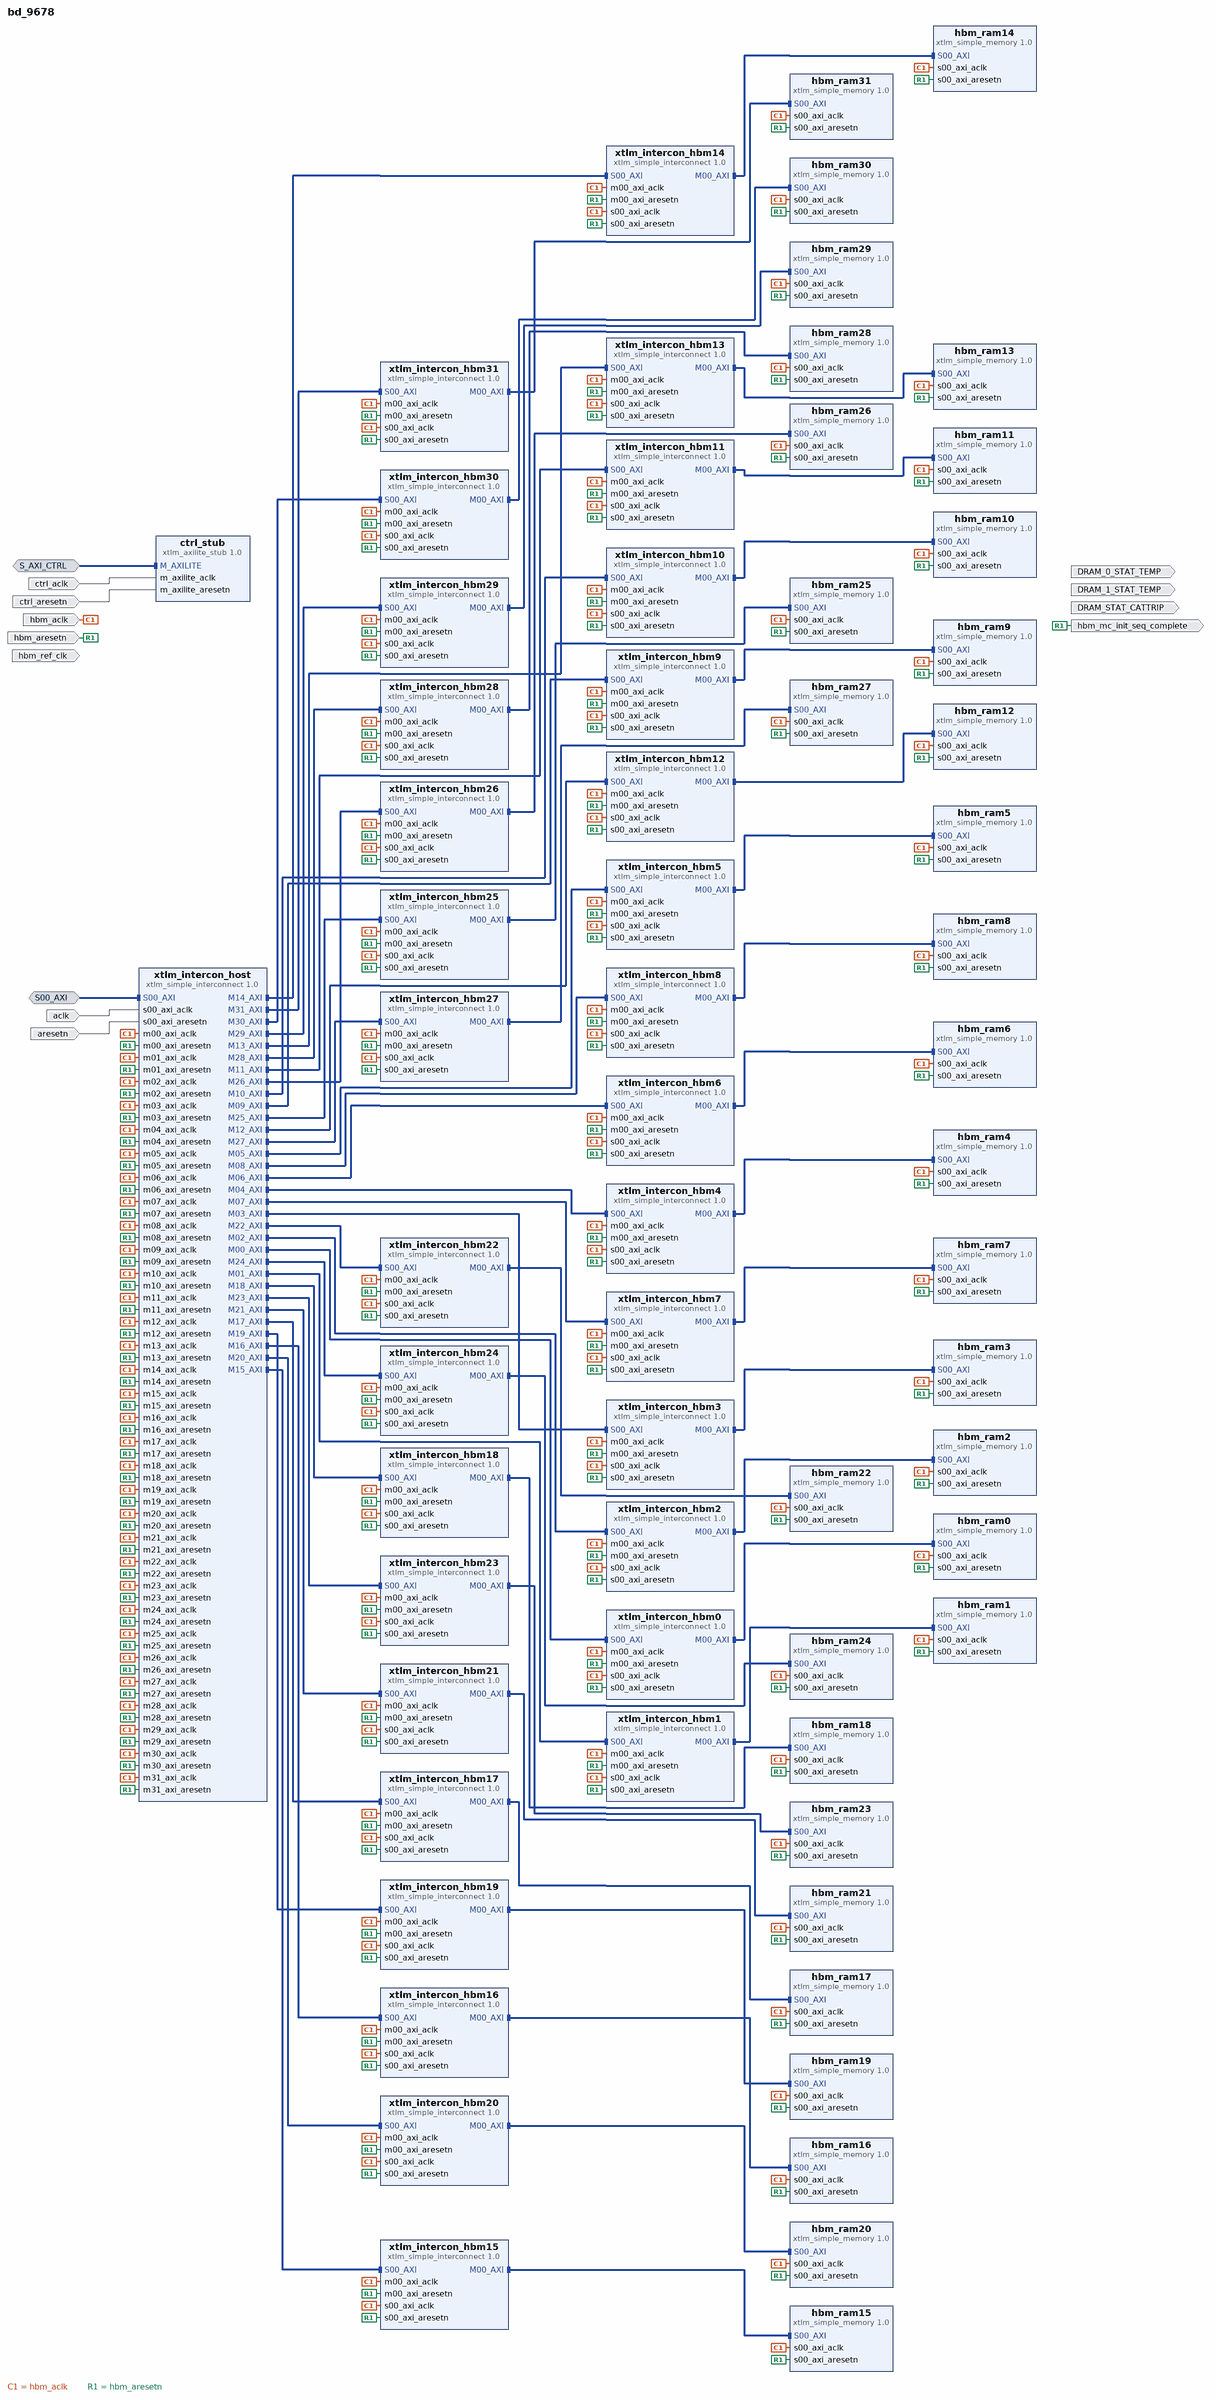
[diagram p0: block diagram of the top level]
# Vivado block design bd_9678, xcu50-fsvh2104-2-e, Vivado 2019.2.1
create_bd_design bd_9678

create_bd_intf_port -mode Slave -vlnv xilinx.com:interface:aximm_rtl:1.0 S_AXI_CTRL
set_property -dict {CONFIG.PROTOCOL AXI4LITE CONFIG.ADDR_WIDTH 23} [get_bd_intf_ports S_AXI_CTRL]
create_bd_intf_port -mode Slave -vlnv xilinx.com:interface:aximm_rtl:1.0 S00_AXI
set_property -dict {CONFIG.ADDR_WIDTH 33} [get_bd_intf_ports S00_AXI]
create_bd_port -dir I -type clk hbm_aclk
create_bd_port -dir I -type rst hbm_aresetn
set_property -dict {CONFIG.POLARITY ACTIVE_LOW} [get_bd_ports hbm_aresetn]
create_bd_port -dir I -type clk hbm_ref_clk
create_bd_port -dir O hbm_mc_init_seq_complete
create_bd_port -dir O DRAM_0_STAT_TEMP
create_bd_port -dir O DRAM_1_STAT_TEMP
create_bd_port -dir O -type intr DRAM_STAT_CATTRIP
create_bd_port -dir I -type clk ctrl_aclk
set_property -dict {CONFIG.ASSOCIATED_BUSIF S_AXI_CTRL CONFIG.ASSOCIATED_RESET ctrl_aresetn} [get_bd_ports ctrl_aclk]
create_bd_port -dir I -type rst ctrl_aresetn
set_property -dict {CONFIG.POLARITY ACTIVE_LOW} [get_bd_ports ctrl_aresetn]
create_bd_port -dir I -type clk aclk
create_bd_port -dir I -type rst aresetn
set_property -dict {CONFIG.POLARITY ACTIVE_LOW} [get_bd_ports aresetn]

create_bd_cell -type ip -vlnv xilinx.com:xilinx:xtlm_simple_interconnect:1.0 xtlm_intercon_host
set_property -dict [list \
  CONFIG.C_M00_A00_ADDR_RANGE 0x0000000010000000 \
  CONFIG.C_M00_A00_BASE_ADDRESS 0x0 \
  CONFIG.C_M00_AXI_ADDR_WIDTH 28 \
  CONFIG.C_M00_AXI_DATA_WIDTH 256 \
  CONFIG.C_M00_AXI_ID_WIDTH 16 \
  CONFIG.C_M00_S00_CONNECTIVITY 1 \
  CONFIG.C_M01_A00_ADDR_RANGE 0x0000000010000000 \
  CONFIG.C_M01_A00_BASE_ADDRESS 0x0000000010000000 \
  CONFIG.C_M01_AXI_ADDR_WIDTH 28 \
  CONFIG.C_M01_AXI_DATA_WIDTH 256 \
  CONFIG.C_M01_AXI_ID_WIDTH 16 \
  CONFIG.C_M01_S00_CONNECTIVITY 1 \
  CONFIG.C_M02_A00_ADDR_RANGE 0x0000000010000000 \
  CONFIG.C_M02_A00_BASE_ADDRESS 0x0000000020000000 \
  CONFIG.C_M02_AXI_ADDR_WIDTH 28 \
  CONFIG.C_M02_AXI_DATA_WIDTH 256 \
  CONFIG.C_M02_AXI_ID_WIDTH 16 \
  CONFIG.C_M02_S00_CONNECTIVITY 1 \
  CONFIG.C_M03_A00_ADDR_RANGE 0x0000000010000000 \
  CONFIG.C_M03_A00_BASE_ADDRESS 0x0000000030000000 \
  CONFIG.C_M03_AXI_ADDR_WIDTH 28 \
  CONFIG.C_M03_AXI_DATA_WIDTH 256 \
  CONFIG.C_M03_AXI_ID_WIDTH 16 \
  CONFIG.C_M03_S00_CONNECTIVITY 1 \
  CONFIG.C_M04_A00_ADDR_RANGE 0x0000000010000000 \
  CONFIG.C_M04_A00_BASE_ADDRESS 0x0000000040000000 \
  CONFIG.C_M04_AXI_ADDR_WIDTH 28 \
  CONFIG.C_M04_AXI_DATA_WIDTH 256 \
  CONFIG.C_M04_AXI_ID_WIDTH 16 \
  CONFIG.C_M04_S00_CONNECTIVITY 1 \
  CONFIG.C_M05_A00_ADDR_RANGE 0x0000000010000000 \
  CONFIG.C_M05_A00_BASE_ADDRESS 0x0000000050000000 \
  CONFIG.C_M05_AXI_ADDR_WIDTH 28 \
  CONFIG.C_M05_AXI_DATA_WIDTH 256 \
  CONFIG.C_M05_AXI_ID_WIDTH 16 \
  CONFIG.C_M05_S00_CONNECTIVITY 1 \
  CONFIG.C_M06_A00_ADDR_RANGE 0x0000000010000000 \
  CONFIG.C_M06_A00_BASE_ADDRESS 0x0000000060000000 \
  CONFIG.C_M06_AXI_ADDR_WIDTH 28 \
  CONFIG.C_M06_AXI_DATA_WIDTH 256 \
  CONFIG.C_M06_AXI_ID_WIDTH 16 \
  CONFIG.C_M06_S00_CONNECTIVITY 1 \
  CONFIG.C_M07_A00_ADDR_RANGE 0x0000000010000000 \
  CONFIG.C_M07_A00_BASE_ADDRESS 0x0000000070000000 \
  CONFIG.C_M07_AXI_ADDR_WIDTH 28 \
  CONFIG.C_M07_AXI_DATA_WIDTH 256 \
  CONFIG.C_M07_AXI_ID_WIDTH 16 \
  CONFIG.C_M07_S00_CONNECTIVITY 1 \
  CONFIG.C_M08_A00_ADDR_RANGE 0x0000000010000000 \
  CONFIG.C_M08_A00_BASE_ADDRESS 0x0000000080000000 \
  CONFIG.C_M08_AXI_ADDR_WIDTH 28 \
  CONFIG.C_M08_AXI_DATA_WIDTH 256 \
  CONFIG.C_M08_AXI_ID_WIDTH 16 \
  CONFIG.C_M08_S00_CONNECTIVITY 1 \
  CONFIG.C_M09_A00_ADDR_RANGE 0x0000000010000000 \
  CONFIG.C_M09_A00_BASE_ADDRESS 0x0000000090000000 \
  CONFIG.C_M09_AXI_ADDR_WIDTH 28 \
  CONFIG.C_M09_AXI_DATA_WIDTH 256 \
  CONFIG.C_M09_AXI_ID_WIDTH 16 \
  CONFIG.C_M09_S00_CONNECTIVITY 1 \
  CONFIG.C_M10_A00_ADDR_RANGE 0x0000000010000000 \
  CONFIG.C_M10_A00_BASE_ADDRESS 0x00000000A0000000 \
  CONFIG.C_M10_AXI_ADDR_WIDTH 28 \
  CONFIG.C_M10_AXI_DATA_WIDTH 256 \
  CONFIG.C_M10_AXI_ID_WIDTH 16 \
  CONFIG.C_M10_S00_CONNECTIVITY 1 \
  CONFIG.C_M11_A00_ADDR_RANGE 0x0000000010000000 \
  CONFIG.C_M11_A00_BASE_ADDRESS 0x00000000B0000000 \
  CONFIG.C_M11_AXI_ADDR_WIDTH 28 \
  CONFIG.C_M11_AXI_DATA_WIDTH 256 \
  CONFIG.C_M11_AXI_ID_WIDTH 16 \
  CONFIG.C_M11_S00_CONNECTIVITY 1 \
  CONFIG.C_M12_A00_ADDR_RANGE 0x0000000010000000 \
  CONFIG.C_M12_A00_BASE_ADDRESS 0x00000000C0000000 \
  CONFIG.C_M12_AXI_ADDR_WIDTH 28 \
  CONFIG.C_M12_AXI_DATA_WIDTH 256 \
  CONFIG.C_M12_AXI_ID_WIDTH 16 \
  CONFIG.C_M12_S00_CONNECTIVITY 1 \
  CONFIG.C_M13_A00_ADDR_RANGE 0x0000000010000000 \
  CONFIG.C_M13_A00_BASE_ADDRESS 0x00000000D0000000 \
  CONFIG.C_M13_AXI_ADDR_WIDTH 28 \
  CONFIG.C_M13_AXI_DATA_WIDTH 256 \
  CONFIG.C_M13_AXI_ID_WIDTH 16 \
  CONFIG.C_M13_S00_CONNECTIVITY 1 \
  CONFIG.C_M14_A00_ADDR_RANGE 0x0000000010000000 \
  CONFIG.C_M14_A00_BASE_ADDRESS 0x00000000E0000000 \
  CONFIG.C_M14_AXI_ADDR_WIDTH 28 \
  CONFIG.C_M14_AXI_DATA_WIDTH 256 \
  CONFIG.C_M14_AXI_ID_WIDTH 16 \
  CONFIG.C_M14_S00_CONNECTIVITY 1 \
  CONFIG.C_M15_A00_ADDR_RANGE 0x0000000010000000 \
  CONFIG.C_M15_A00_BASE_ADDRESS 0x00000000F0000000 \
  CONFIG.C_M15_AXI_ADDR_WIDTH 28 \
  CONFIG.C_M15_AXI_DATA_WIDTH 256 \
  CONFIG.C_M15_AXI_ID_WIDTH 16 \
  CONFIG.C_M15_S00_CONNECTIVITY 1 \
  CONFIG.C_M16_A00_ADDR_RANGE 0x0000000010000000 \
  CONFIG.C_M16_A00_BASE_ADDRESS 0x0000000100000000 \
  CONFIG.C_M16_AXI_ADDR_WIDTH 28 \
  CONFIG.C_M16_AXI_DATA_WIDTH 256 \
  CONFIG.C_M16_AXI_ID_WIDTH 16 \
  CONFIG.C_M16_S00_CONNECTIVITY 1 \
  CONFIG.C_M17_A00_ADDR_RANGE 0x0000000010000000 \
  CONFIG.C_M17_A00_BASE_ADDRESS 0x0000000110000000 \
  CONFIG.C_M17_AXI_ADDR_WIDTH 28 \
  CONFIG.C_M17_AXI_DATA_WIDTH 256 \
  CONFIG.C_M17_AXI_ID_WIDTH 16 \
  CONFIG.C_M17_S00_CONNECTIVITY 1 \
  CONFIG.C_M18_A00_ADDR_RANGE 0x0000000010000000 \
  CONFIG.C_M18_A00_BASE_ADDRESS 0x0000000120000000 \
  CONFIG.C_M18_AXI_ADDR_WIDTH 28 \
  CONFIG.C_M18_AXI_DATA_WIDTH 256 \
  CONFIG.C_M18_AXI_ID_WIDTH 16 \
  CONFIG.C_M18_S00_CONNECTIVITY 1 \
  CONFIG.C_M19_A00_ADDR_RANGE 0x0000000010000000 \
  CONFIG.C_M19_A00_BASE_ADDRESS 0x0000000130000000 \
  CONFIG.C_M19_AXI_ADDR_WIDTH 28 \
  CONFIG.C_M19_AXI_DATA_WIDTH 256 \
  CONFIG.C_M19_AXI_ID_WIDTH 16 \
  CONFIG.C_M19_S00_CONNECTIVITY 1 \
  CONFIG.C_M20_A00_ADDR_RANGE 0x0000000010000000 \
  CONFIG.C_M20_A00_BASE_ADDRESS 0x0000000140000000 \
  CONFIG.C_M20_AXI_ADDR_WIDTH 28 \
  CONFIG.C_M20_AXI_DATA_WIDTH 256 \
  CONFIG.C_M20_AXI_ID_WIDTH 16 \
  CONFIG.C_M20_S00_CONNECTIVITY 1 \
  CONFIG.C_M21_A00_ADDR_RANGE 0x0000000010000000 \
  CONFIG.C_M21_A00_BASE_ADDRESS 0x0000000150000000 \
  CONFIG.C_M21_AXI_ADDR_WIDTH 28 \
  CONFIG.C_M21_AXI_DATA_WIDTH 256 \
  CONFIG.C_M21_AXI_ID_WIDTH 16 \
  CONFIG.C_M21_S00_CONNECTIVITY 1 \
  CONFIG.C_M22_A00_ADDR_RANGE 0x0000000010000000 \
  CONFIG.C_M22_A00_BASE_ADDRESS 0x0000000160000000 \
  CONFIG.C_M22_AXI_ADDR_WIDTH 28 \
  CONFIG.C_M22_AXI_DATA_WIDTH 256 \
  CONFIG.C_M22_AXI_ID_WIDTH 16 \
  CONFIG.C_M22_S00_CONNECTIVITY 1 \
  CONFIG.C_M23_A00_ADDR_RANGE 0x0000000010000000 \
  CONFIG.C_M23_A00_BASE_ADDRESS 0x0000000170000000 \
  CONFIG.C_M23_AXI_ADDR_WIDTH 28 \
  CONFIG.C_M23_AXI_DATA_WIDTH 256 \
  CONFIG.C_M23_AXI_ID_WIDTH 16 \
  CONFIG.C_M23_S00_CONNECTIVITY 1 \
  CONFIG.C_M24_A00_ADDR_RANGE 0x0000000010000000 \
  CONFIG.C_M24_A00_BASE_ADDRESS 0x0000000180000000 \
  CONFIG.C_M24_AXI_ADDR_WIDTH 28 \
  CONFIG.C_M24_AXI_DATA_WIDTH 256 \
  CONFIG.C_M24_AXI_ID_WIDTH 16 \
  CONFIG.C_M24_S00_CONNECTIVITY 1 \
  CONFIG.C_M25_A00_ADDR_RANGE 0x0000000010000000 \
  CONFIG.C_M25_A00_BASE_ADDRESS 0x0000000190000000 \
  CONFIG.C_M25_AXI_ADDR_WIDTH 28 \
  CONFIG.C_M25_AXI_DATA_WIDTH 256 \
  CONFIG.C_M25_AXI_ID_WIDTH 16 \
  CONFIG.C_M25_S00_CONNECTIVITY 1 \
  CONFIG.C_M26_A00_ADDR_RANGE 0x0000000010000000 \
  CONFIG.C_M26_A00_BASE_ADDRESS 0x00000001A0000000 \
  CONFIG.C_M26_AXI_ADDR_WIDTH 28 \
  CONFIG.C_M26_AXI_DATA_WIDTH 256 \
  CONFIG.C_M26_AXI_ID_WIDTH 16 \
  CONFIG.C_M26_S00_CONNECTIVITY 1 \
  CONFIG.C_M27_A00_ADDR_RANGE 0x0000000010000000 \
  CONFIG.C_M27_A00_BASE_ADDRESS 0x00000001B0000000 \
  CONFIG.C_M27_AXI_ADDR_WIDTH 28 \
  CONFIG.C_M27_AXI_DATA_WIDTH 256 \
  CONFIG.C_M27_AXI_ID_WIDTH 16 \
  CONFIG.C_M27_S00_CONNECTIVITY 1 \
  CONFIG.C_M28_A00_ADDR_RANGE 0x0000000010000000 \
  CONFIG.C_M28_A00_BASE_ADDRESS 0x00000001C0000000 \
  CONFIG.C_M28_AXI_ADDR_WIDTH 28 \
  CONFIG.C_M28_AXI_DATA_WIDTH 256 \
  CONFIG.C_M28_AXI_ID_WIDTH 16 \
  CONFIG.C_M28_S00_CONNECTIVITY 1 \
  CONFIG.C_M29_A00_ADDR_RANGE 0x0000000010000000 \
  CONFIG.C_M29_A00_BASE_ADDRESS 0x00000001D0000000 \
  CONFIG.C_M29_AXI_ADDR_WIDTH 28 \
  CONFIG.C_M29_AXI_DATA_WIDTH 256 \
  CONFIG.C_M29_AXI_ID_WIDTH 16 \
  CONFIG.C_M29_S00_CONNECTIVITY 1 \
  CONFIG.C_M30_A00_ADDR_RANGE 0x0000000010000000 \
  CONFIG.C_M30_A00_BASE_ADDRESS 0x00000001E0000000 \
  CONFIG.C_M30_AXI_ADDR_WIDTH 28 \
  CONFIG.C_M30_AXI_DATA_WIDTH 256 \
  CONFIG.C_M30_AXI_ID_WIDTH 16 \
  CONFIG.C_M30_S00_CONNECTIVITY 1 \
  CONFIG.C_M31_A00_ADDR_RANGE 0x0000000010000000 \
  CONFIG.C_M31_A00_BASE_ADDRESS 0x00000001F0000000 \
  CONFIG.C_M31_AXI_ADDR_WIDTH 28 \
  CONFIG.C_M31_AXI_DATA_WIDTH 256 \
  CONFIG.C_M31_AXI_ID_WIDTH 16 \
  CONFIG.C_M31_S00_CONNECTIVITY 1 \
  CONFIG.C_NUM_MI 32 \
  CONFIG.C_NUM_SI 1 \
  CONFIG.C_S00_AXI_ADDR_WIDTH 64 \
  CONFIG.C_S00_AXI_ARUSER_WIDTH 1 \
  CONFIG.C_S00_AXI_AWUSER_WIDTH 1 \
  CONFIG.C_S00_AXI_BUSER_WIDTH 1 \
  CONFIG.C_S00_AXI_DATA_WIDTH 32 \
  CONFIG.C_S00_AXI_HAS_BRESP true \
  CONFIG.C_S00_AXI_HAS_BURST true \
  CONFIG.C_S00_AXI_HAS_CACHE true \
  CONFIG.C_S00_AXI_HAS_LOCK true \
  CONFIG.C_S00_AXI_HAS_PROT true \
  CONFIG.C_S00_AXI_HAS_QOS true \
  CONFIG.C_S00_AXI_HAS_REGION false \
  CONFIG.C_S00_AXI_HAS_RRESP true \
  CONFIG.C_S00_AXI_HAS_WSTRB true \
  CONFIG.C_S00_AXI_ID_WIDTH 1 \
  CONFIG.C_S00_AXI_RUSER_WIDTH 1 \
  CONFIG.C_S00_AXI_WUSER_WIDTH 1 \
] [get_bd_cells xtlm_intercon_host]
create_bd_cell -type ip -vlnv xilinx.com:xilinx:xtlm_simple_memory:1.0 hbm_ram0
set_property -dict [list \
  CONFIG.C_MEM_SIZE 0x0000000010000000 \
  CONFIG.C_S00_AXI_ADDR_WIDTH 28 \
  CONFIG.C_S00_AXI_BASEADDR 0x00000000 \
  CONFIG.C_S00_AXI_DATA_WIDTH 256 \
  CONFIG.C_S00_AXI_HIGHADDR 0x0FFFFFFF \
] [get_bd_cells hbm_ram0]
create_bd_cell -type ip -vlnv xilinx.com:xilinx:xtlm_simple_interconnect:1.0 xtlm_intercon_hbm0
set_property -dict [list \
  CONFIG.C_M00_A00_ADDR_RANGE 0x0000000010000000 \
  CONFIG.C_M00_A00_BASE_ADDRESS 0x0 \
  CONFIG.C_M00_AXI_ADDR_WIDTH 28 \
  CONFIG.C_M00_AXI_DATA_WIDTH 256 \
  CONFIG.C_M00_AXI_ID_WIDTH 16 \
  CONFIG.C_NUM_MI 1 \
  CONFIG.C_NUM_SI 1 \
  CONFIG.C_S00_AXI_ADDR_WIDTH 28 \
  CONFIG.C_S00_AXI_DATA_WIDTH 256 \
  CONFIG.C_S00_AXI_ID_WIDTH 16 \
] [get_bd_cells xtlm_intercon_hbm0]
create_bd_cell -type ip -vlnv xilinx.com:xilinx:xtlm_simple_memory:1.0 hbm_ram1
set_property -dict [list \
  CONFIG.C_MEM_SIZE 0x0000000010000000 \
  CONFIG.C_S00_AXI_ADDR_WIDTH 28 \
  CONFIG.C_S00_AXI_BASEADDR 0x00000000 \
  CONFIG.C_S00_AXI_DATA_WIDTH 256 \
  CONFIG.C_S00_AXI_HIGHADDR 0x0FFFFFFF \
] [get_bd_cells hbm_ram1]
create_bd_cell -type ip -vlnv xilinx.com:xilinx:xtlm_simple_interconnect:1.0 xtlm_intercon_hbm1
set_property -dict [list \
  CONFIG.C_M00_A00_ADDR_RANGE 0x0000000010000000 \
  CONFIG.C_M00_A00_BASE_ADDRESS 0x0000000010000000 \
  CONFIG.C_M00_AXI_ADDR_WIDTH 28 \
  CONFIG.C_M00_AXI_DATA_WIDTH 256 \
  CONFIG.C_M00_AXI_ID_WIDTH 16 \
  CONFIG.C_NUM_MI 1 \
  CONFIG.C_NUM_SI 1 \
  CONFIG.C_S00_AXI_ADDR_WIDTH 28 \
  CONFIG.C_S00_AXI_DATA_WIDTH 256 \
  CONFIG.C_S00_AXI_ID_WIDTH 16 \
] [get_bd_cells xtlm_intercon_hbm1]
create_bd_cell -type ip -vlnv xilinx.com:xilinx:xtlm_simple_memory:1.0 hbm_ram2
set_property -dict [list \
  CONFIG.C_MEM_SIZE 0x0000000010000000 \
  CONFIG.C_S00_AXI_ADDR_WIDTH 28 \
  CONFIG.C_S00_AXI_BASEADDR 0x00000000 \
  CONFIG.C_S00_AXI_DATA_WIDTH 256 \
  CONFIG.C_S00_AXI_HIGHADDR 0x0FFFFFFF \
] [get_bd_cells hbm_ram2]
create_bd_cell -type ip -vlnv xilinx.com:xilinx:xtlm_simple_interconnect:1.0 xtlm_intercon_hbm2
set_property -dict [list \
  CONFIG.C_M00_A00_ADDR_RANGE 0x0000000010000000 \
  CONFIG.C_M00_A00_BASE_ADDRESS 0x0000000020000000 \
  CONFIG.C_M00_AXI_ADDR_WIDTH 28 \
  CONFIG.C_M00_AXI_DATA_WIDTH 256 \
  CONFIG.C_M00_AXI_ID_WIDTH 16 \
  CONFIG.C_NUM_MI 1 \
  CONFIG.C_NUM_SI 1 \
  CONFIG.C_S00_AXI_ADDR_WIDTH 28 \
  CONFIG.C_S00_AXI_DATA_WIDTH 256 \
  CONFIG.C_S00_AXI_ID_WIDTH 16 \
] [get_bd_cells xtlm_intercon_hbm2]
create_bd_cell -type ip -vlnv xilinx.com:xilinx:xtlm_simple_memory:1.0 hbm_ram3
set_property -dict [list \
  CONFIG.C_MEM_SIZE 0x0000000010000000 \
  CONFIG.C_S00_AXI_ADDR_WIDTH 28 \
  CONFIG.C_S00_AXI_BASEADDR 0x00000000 \
  CONFIG.C_S00_AXI_DATA_WIDTH 256 \
  CONFIG.C_S00_AXI_HIGHADDR 0x0FFFFFFF \
] [get_bd_cells hbm_ram3]
create_bd_cell -type ip -vlnv xilinx.com:xilinx:xtlm_simple_interconnect:1.0 xtlm_intercon_hbm3
set_property -dict [list \
  CONFIG.C_M00_A00_ADDR_RANGE 0x0000000010000000 \
  CONFIG.C_M00_A00_BASE_ADDRESS 0x0000000030000000 \
  CONFIG.C_M00_AXI_ADDR_WIDTH 28 \
  CONFIG.C_M00_AXI_DATA_WIDTH 256 \
  CONFIG.C_M00_AXI_ID_WIDTH 16 \
  CONFIG.C_NUM_MI 1 \
  CONFIG.C_NUM_SI 1 \
  CONFIG.C_S00_AXI_ADDR_WIDTH 28 \
  CONFIG.C_S00_AXI_DATA_WIDTH 256 \
  CONFIG.C_S00_AXI_ID_WIDTH 16 \
] [get_bd_cells xtlm_intercon_hbm3]
create_bd_cell -type ip -vlnv xilinx.com:xilinx:xtlm_simple_memory:1.0 hbm_ram4
set_property -dict [list \
  CONFIG.C_MEM_SIZE 0x0000000010000000 \
  CONFIG.C_S00_AXI_ADDR_WIDTH 28 \
  CONFIG.C_S00_AXI_BASEADDR 0x00000000 \
  CONFIG.C_S00_AXI_DATA_WIDTH 256 \
  CONFIG.C_S00_AXI_HIGHADDR 0x0FFFFFFF \
] [get_bd_cells hbm_ram4]
create_bd_cell -type ip -vlnv xilinx.com:xilinx:xtlm_simple_interconnect:1.0 xtlm_intercon_hbm4
set_property -dict [list \
  CONFIG.C_M00_A00_ADDR_RANGE 0x0000000010000000 \
  CONFIG.C_M00_A00_BASE_ADDRESS 0x0000000040000000 \
  CONFIG.C_M00_AXI_ADDR_WIDTH 28 \
  CONFIG.C_M00_AXI_DATA_WIDTH 256 \
  CONFIG.C_M00_AXI_ID_WIDTH 16 \
  CONFIG.C_NUM_MI 1 \
  CONFIG.C_NUM_SI 1 \
  CONFIG.C_S00_AXI_ADDR_WIDTH 28 \
  CONFIG.C_S00_AXI_DATA_WIDTH 256 \
  CONFIG.C_S00_AXI_ID_WIDTH 16 \
] [get_bd_cells xtlm_intercon_hbm4]
create_bd_cell -type ip -vlnv xilinx.com:xilinx:xtlm_simple_memory:1.0 hbm_ram5
set_property -dict [list \
  CONFIG.C_MEM_SIZE 0x0000000010000000 \
  CONFIG.C_S00_AXI_ADDR_WIDTH 28 \
  CONFIG.C_S00_AXI_BASEADDR 0x00000000 \
  CONFIG.C_S00_AXI_DATA_WIDTH 256 \
  CONFIG.C_S00_AXI_HIGHADDR 0x0FFFFFFF \
] [get_bd_cells hbm_ram5]
create_bd_cell -type ip -vlnv xilinx.com:xilinx:xtlm_simple_interconnect:1.0 xtlm_intercon_hbm5
set_property -dict [list \
  CONFIG.C_M00_A00_ADDR_RANGE 0x0000000010000000 \
  CONFIG.C_M00_A00_BASE_ADDRESS 0x0000000050000000 \
  CONFIG.C_M00_AXI_ADDR_WIDTH 28 \
  CONFIG.C_M00_AXI_DATA_WIDTH 256 \
  CONFIG.C_M00_AXI_ID_WIDTH 16 \
  CONFIG.C_NUM_MI 1 \
  CONFIG.C_NUM_SI 1 \
  CONFIG.C_S00_AXI_ADDR_WIDTH 28 \
  CONFIG.C_S00_AXI_DATA_WIDTH 256 \
  CONFIG.C_S00_AXI_ID_WIDTH 16 \
] [get_bd_cells xtlm_intercon_hbm5]
create_bd_cell -type ip -vlnv xilinx.com:xilinx:xtlm_simple_memory:1.0 hbm_ram6
set_property -dict [list \
  CONFIG.C_MEM_SIZE 0x0000000010000000 \
  CONFIG.C_S00_AXI_ADDR_WIDTH 28 \
  CONFIG.C_S00_AXI_BASEADDR 0x00000000 \
  CONFIG.C_S00_AXI_DATA_WIDTH 256 \
  CONFIG.C_S00_AXI_HIGHADDR 0x0FFFFFFF \
] [get_bd_cells hbm_ram6]
create_bd_cell -type ip -vlnv xilinx.com:xilinx:xtlm_simple_interconnect:1.0 xtlm_intercon_hbm6
set_property -dict [list \
  CONFIG.C_M00_A00_ADDR_RANGE 0x0000000010000000 \
  CONFIG.C_M00_A00_BASE_ADDRESS 0x0000000060000000 \
  CONFIG.C_M00_AXI_ADDR_WIDTH 28 \
  CONFIG.C_M00_AXI_DATA_WIDTH 256 \
  CONFIG.C_M00_AXI_ID_WIDTH 16 \
  CONFIG.C_NUM_MI 1 \
  CONFIG.C_NUM_SI 1 \
  CONFIG.C_S00_AXI_ADDR_WIDTH 28 \
  CONFIG.C_S00_AXI_DATA_WIDTH 256 \
  CONFIG.C_S00_AXI_ID_WIDTH 16 \
] [get_bd_cells xtlm_intercon_hbm6]
create_bd_cell -type ip -vlnv xilinx.com:xilinx:xtlm_simple_memory:1.0 hbm_ram7
set_property -dict [list \
  CONFIG.C_MEM_SIZE 0x0000000010000000 \
  CONFIG.C_S00_AXI_ADDR_WIDTH 28 \
  CONFIG.C_S00_AXI_BASEADDR 0x00000000 \
  CONFIG.C_S00_AXI_DATA_WIDTH 256 \
  CONFIG.C_S00_AXI_HIGHADDR 0x0FFFFFFF \
] [get_bd_cells hbm_ram7]
create_bd_cell -type ip -vlnv xilinx.com:xilinx:xtlm_simple_interconnect:1.0 xtlm_intercon_hbm7
set_property -dict [list \
  CONFIG.C_M00_A00_ADDR_RANGE 0x0000000010000000 \
  CONFIG.C_M00_A00_BASE_ADDRESS 0x0000000070000000 \
  CONFIG.C_M00_AXI_ADDR_WIDTH 28 \
  CONFIG.C_M00_AXI_DATA_WIDTH 256 \
  CONFIG.C_M00_AXI_ID_WIDTH 16 \
  CONFIG.C_NUM_MI 1 \
  CONFIG.C_NUM_SI 1 \
  CONFIG.C_S00_AXI_ADDR_WIDTH 28 \
  CONFIG.C_S00_AXI_DATA_WIDTH 256 \
  CONFIG.C_S00_AXI_ID_WIDTH 16 \
] [get_bd_cells xtlm_intercon_hbm7]
create_bd_cell -type ip -vlnv xilinx.com:xilinx:xtlm_simple_memory:1.0 hbm_ram8
set_property -dict [list \
  CONFIG.C_MEM_SIZE 0x0000000010000000 \
  CONFIG.C_S00_AXI_ADDR_WIDTH 28 \
  CONFIG.C_S00_AXI_BASEADDR 0x00000000 \
  CONFIG.C_S00_AXI_DATA_WIDTH 256 \
  CONFIG.C_S00_AXI_HIGHADDR 0x0FFFFFFF \
] [get_bd_cells hbm_ram8]
create_bd_cell -type ip -vlnv xilinx.com:xilinx:xtlm_simple_interconnect:1.0 xtlm_intercon_hbm8
set_property -dict [list \
  CONFIG.C_M00_A00_ADDR_RANGE 0x0000000010000000 \
  CONFIG.C_M00_A00_BASE_ADDRESS 0x0000000080000000 \
  CONFIG.C_M00_AXI_ADDR_WIDTH 28 \
  CONFIG.C_M00_AXI_DATA_WIDTH 256 \
  CONFIG.C_M00_AXI_ID_WIDTH 16 \
  CONFIG.C_NUM_MI 1 \
  CONFIG.C_NUM_SI 1 \
  CONFIG.C_S00_AXI_ADDR_WIDTH 28 \
  CONFIG.C_S00_AXI_DATA_WIDTH 256 \
  CONFIG.C_S00_AXI_ID_WIDTH 16 \
] [get_bd_cells xtlm_intercon_hbm8]
create_bd_cell -type ip -vlnv xilinx.com:xilinx:xtlm_simple_memory:1.0 hbm_ram9
set_property -dict [list \
  CONFIG.C_MEM_SIZE 0x0000000010000000 \
  CONFIG.C_S00_AXI_ADDR_WIDTH 28 \
  CONFIG.C_S00_AXI_BASEADDR 0x00000000 \
  CONFIG.C_S00_AXI_DATA_WIDTH 256 \
  CONFIG.C_S00_AXI_HIGHADDR 0x0FFFFFFF \
] [get_bd_cells hbm_ram9]
create_bd_cell -type ip -vlnv xilinx.com:xilinx:xtlm_simple_interconnect:1.0 xtlm_intercon_hbm9
set_property -dict [list \
  CONFIG.C_M00_A00_ADDR_RANGE 0x0000000010000000 \
  CONFIG.C_M00_A00_BASE_ADDRESS 0x0000000090000000 \
  CONFIG.C_M00_AXI_ADDR_WIDTH 28 \
  CONFIG.C_M00_AXI_DATA_WIDTH 256 \
  CONFIG.C_M00_AXI_ID_WIDTH 16 \
  CONFIG.C_NUM_MI 1 \
  CONFIG.C_NUM_SI 1 \
  CONFIG.C_S00_AXI_ADDR_WIDTH 28 \
  CONFIG.C_S00_AXI_DATA_WIDTH 256 \
  CONFIG.C_S00_AXI_ID_WIDTH 16 \
] [get_bd_cells xtlm_intercon_hbm9]
create_bd_cell -type ip -vlnv xilinx.com:xilinx:xtlm_simple_memory:1.0 hbm_ram10
set_property -dict [list \
  CONFIG.C_MEM_SIZE 0x0000000010000000 \
  CONFIG.C_S00_AXI_ADDR_WIDTH 28 \
  CONFIG.C_S00_AXI_BASEADDR 0x00000000 \
  CONFIG.C_S00_AXI_DATA_WIDTH 256 \
  CONFIG.C_S00_AXI_HIGHADDR 0x0FFFFFFF \
] [get_bd_cells hbm_ram10]
create_bd_cell -type ip -vlnv xilinx.com:xilinx:xtlm_simple_interconnect:1.0 xtlm_intercon_hbm10
set_property -dict [list \
  CONFIG.C_M00_A00_ADDR_RANGE 0x0000000010000000 \
  CONFIG.C_M00_A00_BASE_ADDRESS 0x00000000A0000000 \
  CONFIG.C_M00_AXI_ADDR_WIDTH 28 \
  CONFIG.C_M00_AXI_DATA_WIDTH 256 \
  CONFIG.C_M00_AXI_ID_WIDTH 16 \
  CONFIG.C_NUM_MI 1 \
  CONFIG.C_NUM_SI 1 \
  CONFIG.C_S00_AXI_ADDR_WIDTH 28 \
  CONFIG.C_S00_AXI_DATA_WIDTH 256 \
  CONFIG.C_S00_AXI_ID_WIDTH 16 \
] [get_bd_cells xtlm_intercon_hbm10]
create_bd_cell -type ip -vlnv xilinx.com:xilinx:xtlm_simple_memory:1.0 hbm_ram11
set_property -dict [list \
  CONFIG.C_MEM_SIZE 0x0000000010000000 \
  CONFIG.C_S00_AXI_ADDR_WIDTH 28 \
  CONFIG.C_S00_AXI_BASEADDR 0x00000000 \
  CONFIG.C_S00_AXI_DATA_WIDTH 256 \
  CONFIG.C_S00_AXI_HIGHADDR 0x0FFFFFFF \
] [get_bd_cells hbm_ram11]
create_bd_cell -type ip -vlnv xilinx.com:xilinx:xtlm_simple_interconnect:1.0 xtlm_intercon_hbm11
set_property -dict [list \
  CONFIG.C_M00_A00_ADDR_RANGE 0x0000000010000000 \
  CONFIG.C_M00_A00_BASE_ADDRESS 0x00000000B0000000 \
  CONFIG.C_M00_AXI_ADDR_WIDTH 28 \
  CONFIG.C_M00_AXI_DATA_WIDTH 256 \
  CONFIG.C_M00_AXI_ID_WIDTH 16 \
  CONFIG.C_NUM_MI 1 \
  CONFIG.C_NUM_SI 1 \
  CONFIG.C_S00_AXI_ADDR_WIDTH 28 \
  CONFIG.C_S00_AXI_DATA_WIDTH 256 \
  CONFIG.C_S00_AXI_ID_WIDTH 16 \
] [get_bd_cells xtlm_intercon_hbm11]
create_bd_cell -type ip -vlnv xilinx.com:xilinx:xtlm_simple_memory:1.0 hbm_ram12
set_property -dict [list \
  CONFIG.C_MEM_SIZE 0x0000000010000000 \
  CONFIG.C_S00_AXI_ADDR_WIDTH 28 \
  CONFIG.C_S00_AXI_BASEADDR 0x00000000 \
  CONFIG.C_S00_AXI_DATA_WIDTH 256 \
  CONFIG.C_S00_AXI_HIGHADDR 0x0FFFFFFF \
] [get_bd_cells hbm_ram12]
create_bd_cell -type ip -vlnv xilinx.com:xilinx:xtlm_simple_interconnect:1.0 xtlm_intercon_hbm12
set_property -dict [list \
  CONFIG.C_M00_A00_ADDR_RANGE 0x0000000010000000 \
  CONFIG.C_M00_A00_BASE_ADDRESS 0x00000000C0000000 \
  CONFIG.C_M00_AXI_ADDR_WIDTH 28 \
  CONFIG.C_M00_AXI_DATA_WIDTH 256 \
  CONFIG.C_M00_AXI_ID_WIDTH 16 \
  CONFIG.C_NUM_MI 1 \
  CONFIG.C_NUM_SI 1 \
  CONFIG.C_S00_AXI_ADDR_WIDTH 28 \
  CONFIG.C_S00_AXI_DATA_WIDTH 256 \
  CONFIG.C_S00_AXI_ID_WIDTH 16 \
] [get_bd_cells xtlm_intercon_hbm12]
create_bd_cell -type ip -vlnv xilinx.com:xilinx:xtlm_simple_memory:1.0 hbm_ram13
set_property -dict [list \
  CONFIG.C_MEM_SIZE 0x0000000010000000 \
  CONFIG.C_S00_AXI_ADDR_WIDTH 28 \
  CONFIG.C_S00_AXI_BASEADDR 0x00000000 \
  CONFIG.C_S00_AXI_DATA_WIDTH 256 \
  CONFIG.C_S00_AXI_HIGHADDR 0x0FFFFFFF \
] [get_bd_cells hbm_ram13]
create_bd_cell -type ip -vlnv xilinx.com:xilinx:xtlm_simple_interconnect:1.0 xtlm_intercon_hbm13
set_property -dict [list \
  CONFIG.C_M00_A00_ADDR_RANGE 0x0000000010000000 \
  CONFIG.C_M00_A00_BASE_ADDRESS 0x00000000D0000000 \
  CONFIG.C_M00_AXI_ADDR_WIDTH 28 \
  CONFIG.C_M00_AXI_DATA_WIDTH 256 \
  CONFIG.C_M00_AXI_ID_WIDTH 16 \
  CONFIG.C_NUM_MI 1 \
  CONFIG.C_NUM_SI 1 \
  CONFIG.C_S00_AXI_ADDR_WIDTH 28 \
  CONFIG.C_S00_AXI_DATA_WIDTH 256 \
  CONFIG.C_S00_AXI_ID_WIDTH 16 \
] [get_bd_cells xtlm_intercon_hbm13]
create_bd_cell -type ip -vlnv xilinx.com:xilinx:xtlm_simple_memory:1.0 hbm_ram14
set_property -dict [list \
  CONFIG.C_MEM_SIZE 0x0000000010000000 \
  CONFIG.C_S00_AXI_ADDR_WIDTH 28 \
  CONFIG.C_S00_AXI_BASEADDR 0x00000000 \
  CONFIG.C_S00_AXI_DATA_WIDTH 256 \
  CONFIG.C_S00_AXI_HIGHADDR 0x0FFFFFFF \
] [get_bd_cells hbm_ram14]
create_bd_cell -type ip -vlnv xilinx.com:xilinx:xtlm_simple_interconnect:1.0 xtlm_intercon_hbm14
set_property -dict [list \
  CONFIG.C_M00_A00_ADDR_RANGE 0x0000000010000000 \
  CONFIG.C_M00_A00_BASE_ADDRESS 0x00000000E0000000 \
  CONFIG.C_M00_AXI_ADDR_WIDTH 28 \
  CONFIG.C_M00_AXI_DATA_WIDTH 256 \
  CONFIG.C_M00_AXI_ID_WIDTH 16 \
  CONFIG.C_NUM_MI 1 \
  CONFIG.C_NUM_SI 1 \
  CONFIG.C_S00_AXI_ADDR_WIDTH 28 \
  CONFIG.C_S00_AXI_DATA_WIDTH 256 \
  CONFIG.C_S00_AXI_ID_WIDTH 16 \
] [get_bd_cells xtlm_intercon_hbm14]
create_bd_cell -type ip -vlnv xilinx.com:xilinx:xtlm_simple_memory:1.0 hbm_ram15
set_property -dict [list \
  CONFIG.C_MEM_SIZE 0x0000000010000000 \
  CONFIG.C_S00_AXI_ADDR_WIDTH 28 \
  CONFIG.C_S00_AXI_BASEADDR 0x00000000 \
  CONFIG.C_S00_AXI_DATA_WIDTH 256 \
  CONFIG.C_S00_AXI_HIGHADDR 0x0FFFFFFF \
] [get_bd_cells hbm_ram15]
create_bd_cell -type ip -vlnv xilinx.com:xilinx:xtlm_simple_interconnect:1.0 xtlm_intercon_hbm15
set_property -dict [list \
  CONFIG.C_M00_A00_ADDR_RANGE 0x0000000010000000 \
  CONFIG.C_M00_A00_BASE_ADDRESS 0x00000000F0000000 \
  CONFIG.C_M00_AXI_ADDR_WIDTH 28 \
  CONFIG.C_M00_AXI_DATA_WIDTH 256 \
  CONFIG.C_M00_AXI_ID_WIDTH 16 \
  CONFIG.C_NUM_MI 1 \
  CONFIG.C_NUM_SI 1 \
  CONFIG.C_S00_AXI_ADDR_WIDTH 28 \
  CONFIG.C_S00_AXI_DATA_WIDTH 256 \
  CONFIG.C_S00_AXI_ID_WIDTH 16 \
] [get_bd_cells xtlm_intercon_hbm15]
create_bd_cell -type ip -vlnv xilinx.com:xilinx:xtlm_simple_memory:1.0 hbm_ram16
set_property -dict [list \
  CONFIG.C_MEM_SIZE 0x0000000010000000 \
  CONFIG.C_S00_AXI_ADDR_WIDTH 28 \
  CONFIG.C_S00_AXI_BASEADDR 0x00000000 \
  CONFIG.C_S00_AXI_DATA_WIDTH 256 \
  CONFIG.C_S00_AXI_HIGHADDR 0x0FFFFFFF \
] [get_bd_cells hbm_ram16]
create_bd_cell -type ip -vlnv xilinx.com:xilinx:xtlm_simple_interconnect:1.0 xtlm_intercon_hbm16
set_property -dict [list \
  CONFIG.C_M00_A00_ADDR_RANGE 0x0000000010000000 \
  CONFIG.C_M00_A00_BASE_ADDRESS 0x0000000100000000 \
  CONFIG.C_M00_AXI_ADDR_WIDTH 28 \
  CONFIG.C_M00_AXI_DATA_WIDTH 256 \
  CONFIG.C_M00_AXI_ID_WIDTH 16 \
  CONFIG.C_NUM_MI 1 \
  CONFIG.C_NUM_SI 1 \
  CONFIG.C_S00_AXI_ADDR_WIDTH 28 \
  CONFIG.C_S00_AXI_DATA_WIDTH 256 \
  CONFIG.C_S00_AXI_ID_WIDTH 16 \
] [get_bd_cells xtlm_intercon_hbm16]
create_bd_cell -type ip -vlnv xilinx.com:xilinx:xtlm_simple_memory:1.0 hbm_ram17
set_property -dict [list \
  CONFIG.C_MEM_SIZE 0x0000000010000000 \
  CONFIG.C_S00_AXI_ADDR_WIDTH 28 \
  CONFIG.C_S00_AXI_BASEADDR 0x00000000 \
  CONFIG.C_S00_AXI_DATA_WIDTH 256 \
  CONFIG.C_S00_AXI_HIGHADDR 0x0FFFFFFF \
] [get_bd_cells hbm_ram17]
create_bd_cell -type ip -vlnv xilinx.com:xilinx:xtlm_simple_interconnect:1.0 xtlm_intercon_hbm17
set_property -dict [list \
  CONFIG.C_M00_A00_ADDR_RANGE 0x0000000010000000 \
  CONFIG.C_M00_A00_BASE_ADDRESS 0x0000000110000000 \
  CONFIG.C_M00_AXI_ADDR_WIDTH 28 \
  CONFIG.C_M00_AXI_DATA_WIDTH 256 \
  CONFIG.C_M00_AXI_ID_WIDTH 16 \
  CONFIG.C_NUM_MI 1 \
  CONFIG.C_NUM_SI 1 \
  CONFIG.C_S00_AXI_ADDR_WIDTH 28 \
  CONFIG.C_S00_AXI_DATA_WIDTH 256 \
  CONFIG.C_S00_AXI_ID_WIDTH 16 \
] [get_bd_cells xtlm_intercon_hbm17]
create_bd_cell -type ip -vlnv xilinx.com:xilinx:xtlm_simple_memory:1.0 hbm_ram18
set_property -dict [list \
  CONFIG.C_MEM_SIZE 0x0000000010000000 \
  CONFIG.C_S00_AXI_ADDR_WIDTH 28 \
  CONFIG.C_S00_AXI_BASEADDR 0x00000000 \
  CONFIG.C_S00_AXI_DATA_WIDTH 256 \
  CONFIG.C_S00_AXI_HIGHADDR 0x0FFFFFFF \
] [get_bd_cells hbm_ram18]
create_bd_cell -type ip -vlnv xilinx.com:xilinx:xtlm_simple_interconnect:1.0 xtlm_intercon_hbm18
set_property -dict [list \
  CONFIG.C_M00_A00_ADDR_RANGE 0x0000000010000000 \
  CONFIG.C_M00_A00_BASE_ADDRESS 0x0000000120000000 \
  CONFIG.C_M00_AXI_ADDR_WIDTH 28 \
  CONFIG.C_M00_AXI_DATA_WIDTH 256 \
  CONFIG.C_M00_AXI_ID_WIDTH 16 \
  CONFIG.C_NUM_MI 1 \
  CONFIG.C_NUM_SI 1 \
  CONFIG.C_S00_AXI_ADDR_WIDTH 28 \
  CONFIG.C_S00_AXI_DATA_WIDTH 256 \
  CONFIG.C_S00_AXI_ID_WIDTH 16 \
] [get_bd_cells xtlm_intercon_hbm18]
create_bd_cell -type ip -vlnv xilinx.com:xilinx:xtlm_simple_memory:1.0 hbm_ram19
set_property -dict [list \
  CONFIG.C_MEM_SIZE 0x0000000010000000 \
  CONFIG.C_S00_AXI_ADDR_WIDTH 28 \
  CONFIG.C_S00_AXI_BASEADDR 0x00000000 \
  CONFIG.C_S00_AXI_DATA_WIDTH 256 \
  CONFIG.C_S00_AXI_HIGHADDR 0x0FFFFFFF \
] [get_bd_cells hbm_ram19]
create_bd_cell -type ip -vlnv xilinx.com:xilinx:xtlm_simple_interconnect:1.0 xtlm_intercon_hbm19
set_property -dict [list \
  CONFIG.C_M00_A00_ADDR_RANGE 0x0000000010000000 \
  CONFIG.C_M00_A00_BASE_ADDRESS 0x0000000130000000 \
  CONFIG.C_M00_AXI_ADDR_WIDTH 28 \
  CONFIG.C_M00_AXI_DATA_WIDTH 256 \
  CONFIG.C_M00_AXI_ID_WIDTH 16 \
  CONFIG.C_NUM_MI 1 \
  CONFIG.C_NUM_SI 1 \
  CONFIG.C_S00_AXI_ADDR_WIDTH 28 \
  CONFIG.C_S00_AXI_DATA_WIDTH 256 \
  CONFIG.C_S00_AXI_ID_WIDTH 16 \
] [get_bd_cells xtlm_intercon_hbm19]
create_bd_cell -type ip -vlnv xilinx.com:xilinx:xtlm_simple_memory:1.0 hbm_ram20
set_property -dict [list \
  CONFIG.C_MEM_SIZE 0x0000000010000000 \
  CONFIG.C_S00_AXI_ADDR_WIDTH 28 \
  CONFIG.C_S00_AXI_BASEADDR 0x00000000 \
  CONFIG.C_S00_AXI_DATA_WIDTH 256 \
  CONFIG.C_S00_AXI_HIGHADDR 0x0FFFFFFF \
] [get_bd_cells hbm_ram20]
create_bd_cell -type ip -vlnv xilinx.com:xilinx:xtlm_simple_interconnect:1.0 xtlm_intercon_hbm20
set_property -dict [list \
  CONFIG.C_M00_A00_ADDR_RANGE 0x0000000010000000 \
  CONFIG.C_M00_A00_BASE_ADDRESS 0x0000000140000000 \
  CONFIG.C_M00_AXI_ADDR_WIDTH 28 \
  CONFIG.C_M00_AXI_DATA_WIDTH 256 \
  CONFIG.C_M00_AXI_ID_WIDTH 16 \
  CONFIG.C_NUM_MI 1 \
  CONFIG.C_NUM_SI 1 \
  CONFIG.C_S00_AXI_ADDR_WIDTH 28 \
  CONFIG.C_S00_AXI_DATA_WIDTH 256 \
  CONFIG.C_S00_AXI_ID_WIDTH 16 \
] [get_bd_cells xtlm_intercon_hbm20]
create_bd_cell -type ip -vlnv xilinx.com:xilinx:xtlm_simple_memory:1.0 hbm_ram21
set_property -dict [list \
  CONFIG.C_MEM_SIZE 0x0000000010000000 \
  CONFIG.C_S00_AXI_ADDR_WIDTH 28 \
  CONFIG.C_S00_AXI_BASEADDR 0x00000000 \
  CONFIG.C_S00_AXI_DATA_WIDTH 256 \
  CONFIG.C_S00_AXI_HIGHADDR 0x0FFFFFFF \
] [get_bd_cells hbm_ram21]
create_bd_cell -type ip -vlnv xilinx.com:xilinx:xtlm_simple_interconnect:1.0 xtlm_intercon_hbm21
set_property -dict [list \
  CONFIG.C_M00_A00_ADDR_RANGE 0x0000000010000000 \
  CONFIG.C_M00_A00_BASE_ADDRESS 0x0000000150000000 \
  CONFIG.C_M00_AXI_ADDR_WIDTH 28 \
  CONFIG.C_M00_AXI_DATA_WIDTH 256 \
  CONFIG.C_M00_AXI_ID_WIDTH 16 \
  CONFIG.C_NUM_MI 1 \
  CONFIG.C_NUM_SI 1 \
  CONFIG.C_S00_AXI_ADDR_WIDTH 28 \
  CONFIG.C_S00_AXI_DATA_WIDTH 256 \
  CONFIG.C_S00_AXI_ID_WIDTH 16 \
] [get_bd_cells xtlm_intercon_hbm21]
create_bd_cell -type ip -vlnv xilinx.com:xilinx:xtlm_simple_memory:1.0 hbm_ram22
set_property -dict [list \
  CONFIG.C_MEM_SIZE 0x0000000010000000 \
  CONFIG.C_S00_AXI_ADDR_WIDTH 28 \
  CONFIG.C_S00_AXI_BASEADDR 0x00000000 \
  CONFIG.C_S00_AXI_DATA_WIDTH 256 \
  CONFIG.C_S00_AXI_HIGHADDR 0x0FFFFFFF \
] [get_bd_cells hbm_ram22]
create_bd_cell -type ip -vlnv xilinx.com:xilinx:xtlm_simple_interconnect:1.0 xtlm_intercon_hbm22
set_property -dict [list \
  CONFIG.C_M00_A00_ADDR_RANGE 0x0000000010000000 \
  CONFIG.C_M00_A00_BASE_ADDRESS 0x0000000160000000 \
  CONFIG.C_M00_AXI_ADDR_WIDTH 28 \
  CONFIG.C_M00_AXI_DATA_WIDTH 256 \
  CONFIG.C_M00_AXI_ID_WIDTH 16 \
  CONFIG.C_NUM_MI 1 \
  CONFIG.C_NUM_SI 1 \
  CONFIG.C_S00_AXI_ADDR_WIDTH 28 \
  CONFIG.C_S00_AXI_DATA_WIDTH 256 \
  CONFIG.C_S00_AXI_ID_WIDTH 16 \
] [get_bd_cells xtlm_intercon_hbm22]
create_bd_cell -type ip -vlnv xilinx.com:xilinx:xtlm_simple_memory:1.0 hbm_ram23
set_property -dict [list \
  CONFIG.C_MEM_SIZE 0x0000000010000000 \
  CONFIG.C_S00_AXI_ADDR_WIDTH 28 \
  CONFIG.C_S00_AXI_BASEADDR 0x00000000 \
  CONFIG.C_S00_AXI_DATA_WIDTH 256 \
  CONFIG.C_S00_AXI_HIGHADDR 0x0FFFFFFF \
] [get_bd_cells hbm_ram23]
create_bd_cell -type ip -vlnv xilinx.com:xilinx:xtlm_simple_interconnect:1.0 xtlm_intercon_hbm23
set_property -dict [list \
  CONFIG.C_M00_A00_ADDR_RANGE 0x0000000010000000 \
  CONFIG.C_M00_A00_BASE_ADDRESS 0x0000000170000000 \
  CONFIG.C_M00_AXI_ADDR_WIDTH 28 \
  CONFIG.C_M00_AXI_DATA_WIDTH 256 \
  CONFIG.C_M00_AXI_ID_WIDTH 16 \
  CONFIG.C_NUM_MI 1 \
  CONFIG.C_NUM_SI 1 \
  CONFIG.C_S00_AXI_ADDR_WIDTH 28 \
  CONFIG.C_S00_AXI_DATA_WIDTH 256 \
  CONFIG.C_S00_AXI_ID_WIDTH 16 \
] [get_bd_cells xtlm_intercon_hbm23]
create_bd_cell -type ip -vlnv xilinx.com:xilinx:xtlm_simple_memory:1.0 hbm_ram24
set_property -dict [list \
  CONFIG.C_MEM_SIZE 0x0000000010000000 \
  CONFIG.C_S00_AXI_ADDR_WIDTH 28 \
  CONFIG.C_S00_AXI_BASEADDR 0x00000000 \
  CONFIG.C_S00_AXI_DATA_WIDTH 256 \
  CONFIG.C_S00_AXI_HIGHADDR 0x0FFFFFFF \
] [get_bd_cells hbm_ram24]
create_bd_cell -type ip -vlnv xilinx.com:xilinx:xtlm_simple_interconnect:1.0 xtlm_intercon_hbm24
set_property -dict [list \
  CONFIG.C_M00_A00_ADDR_RANGE 0x0000000010000000 \
  CONFIG.C_M00_A00_BASE_ADDRESS 0x0000000180000000 \
  CONFIG.C_M00_AXI_ADDR_WIDTH 28 \
  CONFIG.C_M00_AXI_DATA_WIDTH 256 \
  CONFIG.C_M00_AXI_ID_WIDTH 16 \
  CONFIG.C_NUM_MI 1 \
  CONFIG.C_NUM_SI 1 \
  CONFIG.C_S00_AXI_ADDR_WIDTH 28 \
  CONFIG.C_S00_AXI_DATA_WIDTH 256 \
  CONFIG.C_S00_AXI_ID_WIDTH 16 \
] [get_bd_cells xtlm_intercon_hbm24]
create_bd_cell -type ip -vlnv xilinx.com:xilinx:xtlm_simple_memory:1.0 hbm_ram25
set_property -dict [list \
  CONFIG.C_MEM_SIZE 0x0000000010000000 \
  CONFIG.C_S00_AXI_ADDR_WIDTH 28 \
  CONFIG.C_S00_AXI_BASEADDR 0x00000000 \
  CONFIG.C_S00_AXI_DATA_WIDTH 256 \
  CONFIG.C_S00_AXI_HIGHADDR 0x0FFFFFFF \
] [get_bd_cells hbm_ram25]
create_bd_cell -type ip -vlnv xilinx.com:xilinx:xtlm_simple_interconnect:1.0 xtlm_intercon_hbm25
set_property -dict [list \
  CONFIG.C_M00_A00_ADDR_RANGE 0x0000000010000000 \
  CONFIG.C_M00_A00_BASE_ADDRESS 0x0000000190000000 \
  CONFIG.C_M00_AXI_ADDR_WIDTH 28 \
  CONFIG.C_M00_AXI_DATA_WIDTH 256 \
  CONFIG.C_M00_AXI_ID_WIDTH 16 \
  CONFIG.C_NUM_MI 1 \
  CONFIG.C_NUM_SI 1 \
  CONFIG.C_S00_AXI_ADDR_WIDTH 28 \
  CONFIG.C_S00_AXI_DATA_WIDTH 256 \
  CONFIG.C_S00_AXI_ID_WIDTH 16 \
] [get_bd_cells xtlm_intercon_hbm25]
create_bd_cell -type ip -vlnv xilinx.com:xilinx:xtlm_simple_memory:1.0 hbm_ram26
set_property -dict [list \
  CONFIG.C_MEM_SIZE 0x0000000010000000 \
  CONFIG.C_S00_AXI_ADDR_WIDTH 28 \
  CONFIG.C_S00_AXI_BASEADDR 0x00000000 \
  CONFIG.C_S00_AXI_DATA_WIDTH 256 \
  CONFIG.C_S00_AXI_HIGHADDR 0x0FFFFFFF \
] [get_bd_cells hbm_ram26]
create_bd_cell -type ip -vlnv xilinx.com:xilinx:xtlm_simple_interconnect:1.0 xtlm_intercon_hbm26
set_property -dict [list \
  CONFIG.C_M00_A00_ADDR_RANGE 0x0000000010000000 \
  CONFIG.C_M00_A00_BASE_ADDRESS 0x00000001A0000000 \
  CONFIG.C_M00_AXI_ADDR_WIDTH 28 \
  CONFIG.C_M00_AXI_DATA_WIDTH 256 \
  CONFIG.C_M00_AXI_ID_WIDTH 16 \
  CONFIG.C_NUM_MI 1 \
  CONFIG.C_NUM_SI 1 \
  CONFIG.C_S00_AXI_ADDR_WIDTH 28 \
  CONFIG.C_S00_AXI_DATA_WIDTH 256 \
  CONFIG.C_S00_AXI_ID_WIDTH 16 \
] [get_bd_cells xtlm_intercon_hbm26]
create_bd_cell -type ip -vlnv xilinx.com:xilinx:xtlm_simple_memory:1.0 hbm_ram27
set_property -dict [list \
  CONFIG.C_MEM_SIZE 0x0000000010000000 \
  CONFIG.C_S00_AXI_ADDR_WIDTH 28 \
  CONFIG.C_S00_AXI_BASEADDR 0x00000000 \
  CONFIG.C_S00_AXI_DATA_WIDTH 256 \
  CONFIG.C_S00_AXI_HIGHADDR 0x0FFFFFFF \
] [get_bd_cells hbm_ram27]
create_bd_cell -type ip -vlnv xilinx.com:xilinx:xtlm_simple_interconnect:1.0 xtlm_intercon_hbm27
set_property -dict [list \
  CONFIG.C_M00_A00_ADDR_RANGE 0x0000000010000000 \
  CONFIG.C_M00_A00_BASE_ADDRESS 0x00000001B0000000 \
  CONFIG.C_M00_AXI_ADDR_WIDTH 28 \
  CONFIG.C_M00_AXI_DATA_WIDTH 256 \
  CONFIG.C_M00_AXI_ID_WIDTH 16 \
  CONFIG.C_NUM_MI 1 \
  CONFIG.C_NUM_SI 1 \
  CONFIG.C_S00_AXI_ADDR_WIDTH 28 \
  CONFIG.C_S00_AXI_DATA_WIDTH 256 \
  CONFIG.C_S00_AXI_ID_WIDTH 16 \
] [get_bd_cells xtlm_intercon_hbm27]
create_bd_cell -type ip -vlnv xilinx.com:xilinx:xtlm_simple_memory:1.0 hbm_ram28
set_property -dict [list \
  CONFIG.C_MEM_SIZE 0x0000000010000000 \
  CONFIG.C_S00_AXI_ADDR_WIDTH 28 \
  CONFIG.C_S00_AXI_BASEADDR 0x00000000 \
  CONFIG.C_S00_AXI_DATA_WIDTH 256 \
  CONFIG.C_S00_AXI_HIGHADDR 0x0FFFFFFF \
] [get_bd_cells hbm_ram28]
create_bd_cell -type ip -vlnv xilinx.com:xilinx:xtlm_simple_interconnect:1.0 xtlm_intercon_hbm28
set_property -dict [list \
  CONFIG.C_M00_A00_ADDR_RANGE 0x0000000010000000 \
  CONFIG.C_M00_A00_BASE_ADDRESS 0x00000001C0000000 \
  CONFIG.C_M00_AXI_ADDR_WIDTH 28 \
  CONFIG.C_M00_AXI_DATA_WIDTH 256 \
  CONFIG.C_M00_AXI_ID_WIDTH 16 \
  CONFIG.C_NUM_MI 1 \
  CONFIG.C_NUM_SI 1 \
  CONFIG.C_S00_AXI_ADDR_WIDTH 28 \
  CONFIG.C_S00_AXI_DATA_WIDTH 256 \
  CONFIG.C_S00_AXI_ID_WIDTH 16 \
] [get_bd_cells xtlm_intercon_hbm28]
create_bd_cell -type ip -vlnv xilinx.com:xilinx:xtlm_simple_memory:1.0 hbm_ram29
set_property -dict [list \
  CONFIG.C_MEM_SIZE 0x0000000010000000 \
  CONFIG.C_S00_AXI_ADDR_WIDTH 28 \
  CONFIG.C_S00_AXI_BASEADDR 0x00000000 \
  CONFIG.C_S00_AXI_DATA_WIDTH 256 \
  CONFIG.C_S00_AXI_HIGHADDR 0x0FFFFFFF \
] [get_bd_cells hbm_ram29]
create_bd_cell -type ip -vlnv xilinx.com:xilinx:xtlm_simple_interconnect:1.0 xtlm_intercon_hbm29
set_property -dict [list \
  CONFIG.C_M00_A00_ADDR_RANGE 0x0000000010000000 \
  CONFIG.C_M00_A00_BASE_ADDRESS 0x00000001D0000000 \
  CONFIG.C_M00_AXI_ADDR_WIDTH 28 \
  CONFIG.C_M00_AXI_DATA_WIDTH 256 \
  CONFIG.C_M00_AXI_ID_WIDTH 16 \
  CONFIG.C_NUM_MI 1 \
  CONFIG.C_NUM_SI 1 \
  CONFIG.C_S00_AXI_ADDR_WIDTH 28 \
  CONFIG.C_S00_AXI_DATA_WIDTH 256 \
  CONFIG.C_S00_AXI_ID_WIDTH 16 \
] [get_bd_cells xtlm_intercon_hbm29]
create_bd_cell -type ip -vlnv xilinx.com:xilinx:xtlm_simple_memory:1.0 hbm_ram30
set_property -dict [list \
  CONFIG.C_MEM_SIZE 0x0000000010000000 \
  CONFIG.C_S00_AXI_ADDR_WIDTH 28 \
  CONFIG.C_S00_AXI_BASEADDR 0x00000000 \
  CONFIG.C_S00_AXI_DATA_WIDTH 256 \
  CONFIG.C_S00_AXI_HIGHADDR 0x0FFFFFFF \
] [get_bd_cells hbm_ram30]
create_bd_cell -type ip -vlnv xilinx.com:xilinx:xtlm_simple_interconnect:1.0 xtlm_intercon_hbm30
set_property -dict [list \
  CONFIG.C_M00_A00_ADDR_RANGE 0x0000000010000000 \
  CONFIG.C_M00_A00_BASE_ADDRESS 0x00000001E0000000 \
  CONFIG.C_M00_AXI_ADDR_WIDTH 28 \
  CONFIG.C_M00_AXI_DATA_WIDTH 256 \
  CONFIG.C_M00_AXI_ID_WIDTH 16 \
  CONFIG.C_NUM_MI 1 \
  CONFIG.C_NUM_SI 1 \
  CONFIG.C_S00_AXI_ADDR_WIDTH 28 \
  CONFIG.C_S00_AXI_DATA_WIDTH 256 \
  CONFIG.C_S00_AXI_ID_WIDTH 16 \
] [get_bd_cells xtlm_intercon_hbm30]
create_bd_cell -type ip -vlnv xilinx.com:xilinx:xtlm_simple_memory:1.0 hbm_ram31
set_property -dict [list \
  CONFIG.C_MEM_SIZE 0x0000000010000000 \
  CONFIG.C_S00_AXI_ADDR_WIDTH 28 \
  CONFIG.C_S00_AXI_BASEADDR 0x00000000 \
  CONFIG.C_S00_AXI_DATA_WIDTH 256 \
  CONFIG.C_S00_AXI_HIGHADDR 0x0FFFFFFF \
] [get_bd_cells hbm_ram31]
create_bd_cell -type ip -vlnv xilinx.com:xilinx:xtlm_simple_interconnect:1.0 xtlm_intercon_hbm31
set_property -dict [list \
  CONFIG.C_M00_A00_ADDR_RANGE 0x0000000010000000 \
  CONFIG.C_M00_A00_BASE_ADDRESS 0x00000001F0000000 \
  CONFIG.C_M00_AXI_ADDR_WIDTH 28 \
  CONFIG.C_M00_AXI_DATA_WIDTH 256 \
  CONFIG.C_M00_AXI_ID_WIDTH 16 \
  CONFIG.C_NUM_MI 1 \
  CONFIG.C_NUM_SI 1 \
  CONFIG.C_S00_AXI_ADDR_WIDTH 28 \
  CONFIG.C_S00_AXI_DATA_WIDTH 256 \
  CONFIG.C_S00_AXI_ID_WIDTH 16 \
] [get_bd_cells xtlm_intercon_hbm31]
create_bd_cell -type ip -vlnv xilinx.com:xilinx:xtlm_axilite_stub:1.0 ctrl_stub

# ---- connections ----

connect_bd_intf_net -intf_net hbm_s00 [get_bd_intf_pins hbm_ram0/S00_AXI] [get_bd_intf_pins xtlm_intercon_hbm0/M00_AXI]
connect_bd_intf_net -intf_net host_hbm_s00 [get_bd_intf_pins xtlm_intercon_hbm0/S00_AXI] [get_bd_intf_pins xtlm_intercon_host/M00_AXI]
connect_bd_intf_net -intf_net hbm_s05 [get_bd_intf_pins hbm_ram5/S00_AXI] [get_bd_intf_pins xtlm_intercon_hbm5/M00_AXI]
connect_bd_intf_net -intf_net host_hbm_s05 [get_bd_intf_pins xtlm_intercon_hbm5/S00_AXI] [get_bd_intf_pins xtlm_intercon_host/M05_AXI]
connect_bd_intf_net -intf_net hbm_s17 [get_bd_intf_pins hbm_ram17/S00_AXI] [get_bd_intf_pins xtlm_intercon_hbm17/M00_AXI]
connect_bd_intf_net -intf_net host_hbm_s17 [get_bd_intf_pins xtlm_intercon_hbm17/S00_AXI] [get_bd_intf_pins xtlm_intercon_host/M17_AXI]
connect_bd_intf_net -intf_net hbm_s18 [get_bd_intf_pins hbm_ram18/S00_AXI] [get_bd_intf_pins xtlm_intercon_hbm18/M00_AXI]
connect_bd_intf_net -intf_net host_hbm_s18 [get_bd_intf_pins xtlm_intercon_hbm18/S00_AXI] [get_bd_intf_pins xtlm_intercon_host/M18_AXI]
connect_bd_intf_net -intf_net hbm_s11 [get_bd_intf_pins hbm_ram11/S00_AXI] [get_bd_intf_pins xtlm_intercon_hbm11/M00_AXI]
connect_bd_intf_net -intf_net host_hbm_s11 [get_bd_intf_pins xtlm_intercon_hbm11/S00_AXI] [get_bd_intf_pins xtlm_intercon_host/M11_AXI]
connect_bd_intf_net -intf_net hbm_s09 [get_bd_intf_pins hbm_ram9/S00_AXI] [get_bd_intf_pins xtlm_intercon_hbm9/M00_AXI]
connect_bd_intf_net -intf_net host_hbm_s09 [get_bd_intf_pins xtlm_intercon_hbm9/S00_AXI] [get_bd_intf_pins xtlm_intercon_host/M09_AXI]
connect_bd_intf_net -intf_net hbm_s10 [get_bd_intf_pins hbm_ram10/S00_AXI] [get_bd_intf_pins xtlm_intercon_hbm10/M00_AXI]
connect_bd_intf_net -intf_net host_hbm_s10 [get_bd_intf_pins xtlm_intercon_hbm10/S00_AXI] [get_bd_intf_pins xtlm_intercon_host/M10_AXI]
connect_bd_intf_net -intf_net hbm_s29 [get_bd_intf_pins hbm_ram29/S00_AXI] [get_bd_intf_pins xtlm_intercon_hbm29/M00_AXI]
connect_bd_intf_net -intf_net host_hbm_s29 [get_bd_intf_pins xtlm_intercon_hbm29/S00_AXI] [get_bd_intf_pins xtlm_intercon_host/M29_AXI]
connect_bd_intf_net -intf_net hbm_s22 [get_bd_intf_pins hbm_ram22/S00_AXI] [get_bd_intf_pins xtlm_intercon_hbm22/M00_AXI]
connect_bd_intf_net -intf_net host_hbm_s22 [get_bd_intf_pins xtlm_intercon_hbm22/S00_AXI] [get_bd_intf_pins xtlm_intercon_host/M22_AXI]
connect_bd_intf_net -intf_net hbm_s16 [get_bd_intf_pins hbm_ram16/S00_AXI] [get_bd_intf_pins xtlm_intercon_hbm16/M00_AXI]
connect_bd_intf_net -intf_net host_hbm_s16 [get_bd_intf_pins xtlm_intercon_hbm16/S00_AXI] [get_bd_intf_pins xtlm_intercon_host/M16_AXI]
connect_bd_intf_net -intf_net hbm_s13 [get_bd_intf_pins hbm_ram13/S00_AXI] [get_bd_intf_pins xtlm_intercon_hbm13/M00_AXI]
connect_bd_intf_net -intf_net host_hbm_s13 [get_bd_intf_pins xtlm_intercon_hbm13/S00_AXI] [get_bd_intf_pins xtlm_intercon_host/M13_AXI]
connect_bd_intf_net -intf_net hbm_s30 [get_bd_intf_pins hbm_ram30/S00_AXI] [get_bd_intf_pins xtlm_intercon_hbm30/M00_AXI]
connect_bd_intf_net -intf_net host_hbm_s30 [get_bd_intf_pins xtlm_intercon_hbm30/S00_AXI] [get_bd_intf_pins xtlm_intercon_host/M30_AXI]
connect_bd_intf_net -intf_net hbm_s04 [get_bd_intf_pins hbm_ram4/S00_AXI] [get_bd_intf_pins xtlm_intercon_hbm4/M00_AXI]
connect_bd_intf_net -intf_net hbm_s12 [get_bd_intf_pins hbm_ram12/S00_AXI] [get_bd_intf_pins xtlm_intercon_hbm12/M00_AXI]
connect_bd_intf_net -intf_net host_hbm_s12 [get_bd_intf_pins xtlm_intercon_hbm12/S00_AXI] [get_bd_intf_pins xtlm_intercon_host/M12_AXI]
connect_bd_intf_net -intf_net hbm_s14 [get_bd_intf_pins hbm_ram14/S00_AXI] [get_bd_intf_pins xtlm_intercon_hbm14/M00_AXI]
connect_bd_intf_net -intf_net host_hbm_s14 [get_bd_intf_pins xtlm_intercon_hbm14/S00_AXI] [get_bd_intf_pins xtlm_intercon_host/M14_AXI]
connect_bd_intf_net -intf_net hbm_s08 [get_bd_intf_pins hbm_ram8/S00_AXI] [get_bd_intf_pins xtlm_intercon_hbm8/M00_AXI]
connect_bd_intf_net -intf_net host_hbm_s08 [get_bd_intf_pins xtlm_intercon_hbm8/S00_AXI] [get_bd_intf_pins xtlm_intercon_host/M08_AXI]
connect_bd_intf_net -intf_net hbm_s28 [get_bd_intf_pins hbm_ram28/S00_AXI] [get_bd_intf_pins xtlm_intercon_hbm28/M00_AXI]
connect_bd_intf_net -intf_net host_hbm_s28 [get_bd_intf_pins xtlm_intercon_hbm28/S00_AXI] [get_bd_intf_pins xtlm_intercon_host/M28_AXI]
connect_bd_intf_net -intf_net hbm_s25 [get_bd_intf_pins hbm_ram25/S00_AXI] [get_bd_intf_pins xtlm_intercon_hbm25/M00_AXI]
connect_bd_intf_net -intf_net host_hbm_s25 [get_bd_intf_pins xtlm_intercon_hbm25/S00_AXI] [get_bd_intf_pins xtlm_intercon_host/M25_AXI]
connect_bd_intf_net -intf_net hbm_s31 [get_bd_intf_pins hbm_ram31/S00_AXI] [get_bd_intf_pins xtlm_intercon_hbm31/M00_AXI]
connect_bd_intf_net -intf_net host_hbm_s31 [get_bd_intf_pins xtlm_intercon_hbm31/S00_AXI] [get_bd_intf_pins xtlm_intercon_host/M31_AXI]
connect_bd_intf_net -intf_net slave_s00 [get_bd_intf_ports S00_AXI] [get_bd_intf_pins xtlm_intercon_host/S00_AXI]
connect_bd_intf_net [get_bd_intf_ports S_AXI_CTRL] [get_bd_intf_pins ctrl_stub/M_AXILITE]
connect_bd_intf_net -intf_net hbm_s26 [get_bd_intf_pins hbm_ram26/S00_AXI] [get_bd_intf_pins xtlm_intercon_hbm26/M00_AXI]
connect_bd_intf_net -intf_net host_hbm_s26 [get_bd_intf_pins xtlm_intercon_hbm26/S00_AXI] [get_bd_intf_pins xtlm_intercon_host/M26_AXI]
connect_bd_intf_net -intf_net hbm_s21 [get_bd_intf_pins hbm_ram21/S00_AXI] [get_bd_intf_pins xtlm_intercon_hbm21/M00_AXI]
connect_bd_intf_net -intf_net host_hbm_s21 [get_bd_intf_pins xtlm_intercon_hbm21/S00_AXI] [get_bd_intf_pins xtlm_intercon_host/M21_AXI]
connect_bd_intf_net -intf_net hbm_s19 [get_bd_intf_pins hbm_ram19/S00_AXI] [get_bd_intf_pins xtlm_intercon_hbm19/M00_AXI]
connect_bd_intf_net -intf_net host_hbm_s19 [get_bd_intf_pins xtlm_intercon_hbm19/S00_AXI] [get_bd_intf_pins xtlm_intercon_host/M19_AXI]
connect_bd_intf_net -intf_net hbm_s06 [get_bd_intf_pins hbm_ram6/S00_AXI] [get_bd_intf_pins xtlm_intercon_hbm6/M00_AXI]
connect_bd_intf_net -intf_net host_hbm_s06 [get_bd_intf_pins xtlm_intercon_hbm6/S00_AXI] [get_bd_intf_pins xtlm_intercon_host/M06_AXI]
connect_bd_intf_net -intf_net hbm_s23 [get_bd_intf_pins hbm_ram23/S00_AXI] [get_bd_intf_pins xtlm_intercon_hbm23/M00_AXI]
connect_bd_intf_net -intf_net host_hbm_s23 [get_bd_intf_pins xtlm_intercon_hbm23/S00_AXI] [get_bd_intf_pins xtlm_intercon_host/M23_AXI]
connect_bd_intf_net -intf_net host_hbm_s04 [get_bd_intf_pins xtlm_intercon_hbm4/S00_AXI] [get_bd_intf_pins xtlm_intercon_host/M04_AXI]
connect_bd_intf_net -intf_net host_hbm_s02 [get_bd_intf_pins xtlm_intercon_hbm2/S00_AXI] [get_bd_intf_pins xtlm_intercon_host/M02_AXI]
connect_bd_intf_net -intf_net hbm_s02 [get_bd_intf_pins hbm_ram2/S00_AXI] [get_bd_intf_pins xtlm_intercon_hbm2/M00_AXI]
connect_bd_intf_net -intf_net hbm_s03 [get_bd_intf_pins hbm_ram3/S00_AXI] [get_bd_intf_pins xtlm_intercon_hbm3/M00_AXI]
connect_bd_intf_net -intf_net host_hbm_s03 [get_bd_intf_pins xtlm_intercon_hbm3/S00_AXI] [get_bd_intf_pins xtlm_intercon_host/M03_AXI]
connect_bd_intf_net -intf_net hbm_s07 [get_bd_intf_pins hbm_ram7/S00_AXI] [get_bd_intf_pins xtlm_intercon_hbm7/M00_AXI]
connect_bd_intf_net -intf_net host_hbm_s07 [get_bd_intf_pins xtlm_intercon_hbm7/S00_AXI] [get_bd_intf_pins xtlm_intercon_host/M07_AXI]
connect_bd_intf_net -intf_net hbm_s24 [get_bd_intf_pins hbm_ram24/S00_AXI] [get_bd_intf_pins xtlm_intercon_hbm24/M00_AXI]
connect_bd_intf_net -intf_net host_hbm_s24 [get_bd_intf_pins xtlm_intercon_hbm24/S00_AXI] [get_bd_intf_pins xtlm_intercon_host/M24_AXI]
connect_bd_intf_net -intf_net hbm_s20 [get_bd_intf_pins hbm_ram20/S00_AXI] [get_bd_intf_pins xtlm_intercon_hbm20/M00_AXI]
connect_bd_intf_net -intf_net host_hbm_s20 [get_bd_intf_pins xtlm_intercon_hbm20/S00_AXI] [get_bd_intf_pins xtlm_intercon_host/M20_AXI]
connect_bd_intf_net -intf_net hbm_s27 [get_bd_intf_pins hbm_ram27/S00_AXI] [get_bd_intf_pins xtlm_intercon_hbm27/M00_AXI]
connect_bd_intf_net -intf_net host_hbm_s27 [get_bd_intf_pins xtlm_intercon_hbm27/S00_AXI] [get_bd_intf_pins xtlm_intercon_host/M27_AXI]
connect_bd_intf_net -intf_net hbm_s15 [get_bd_intf_pins hbm_ram15/S00_AXI] [get_bd_intf_pins xtlm_intercon_hbm15/M00_AXI]
connect_bd_intf_net -intf_net host_hbm_s15 [get_bd_intf_pins xtlm_intercon_hbm15/S00_AXI] [get_bd_intf_pins xtlm_intercon_host/M15_AXI]
connect_bd_intf_net -intf_net hbm_s01 [get_bd_intf_pins hbm_ram1/S00_AXI] [get_bd_intf_pins xtlm_intercon_hbm1/M00_AXI]
connect_bd_intf_net -intf_net host_hbm_s01 [get_bd_intf_pins xtlm_intercon_hbm1/S00_AXI] [get_bd_intf_pins xtlm_intercon_host/M01_AXI]
